# EAGLE schematic DCLoad (EAGLE 6.5.0)
20W Dynamic DC Contant Current Electonic Load
PART_NUM: DCL1B; REV: B; TITLE: Constant Current DC Load Project
Assembly variants: BASE, NOTEMPFAN, NOLOADBTN
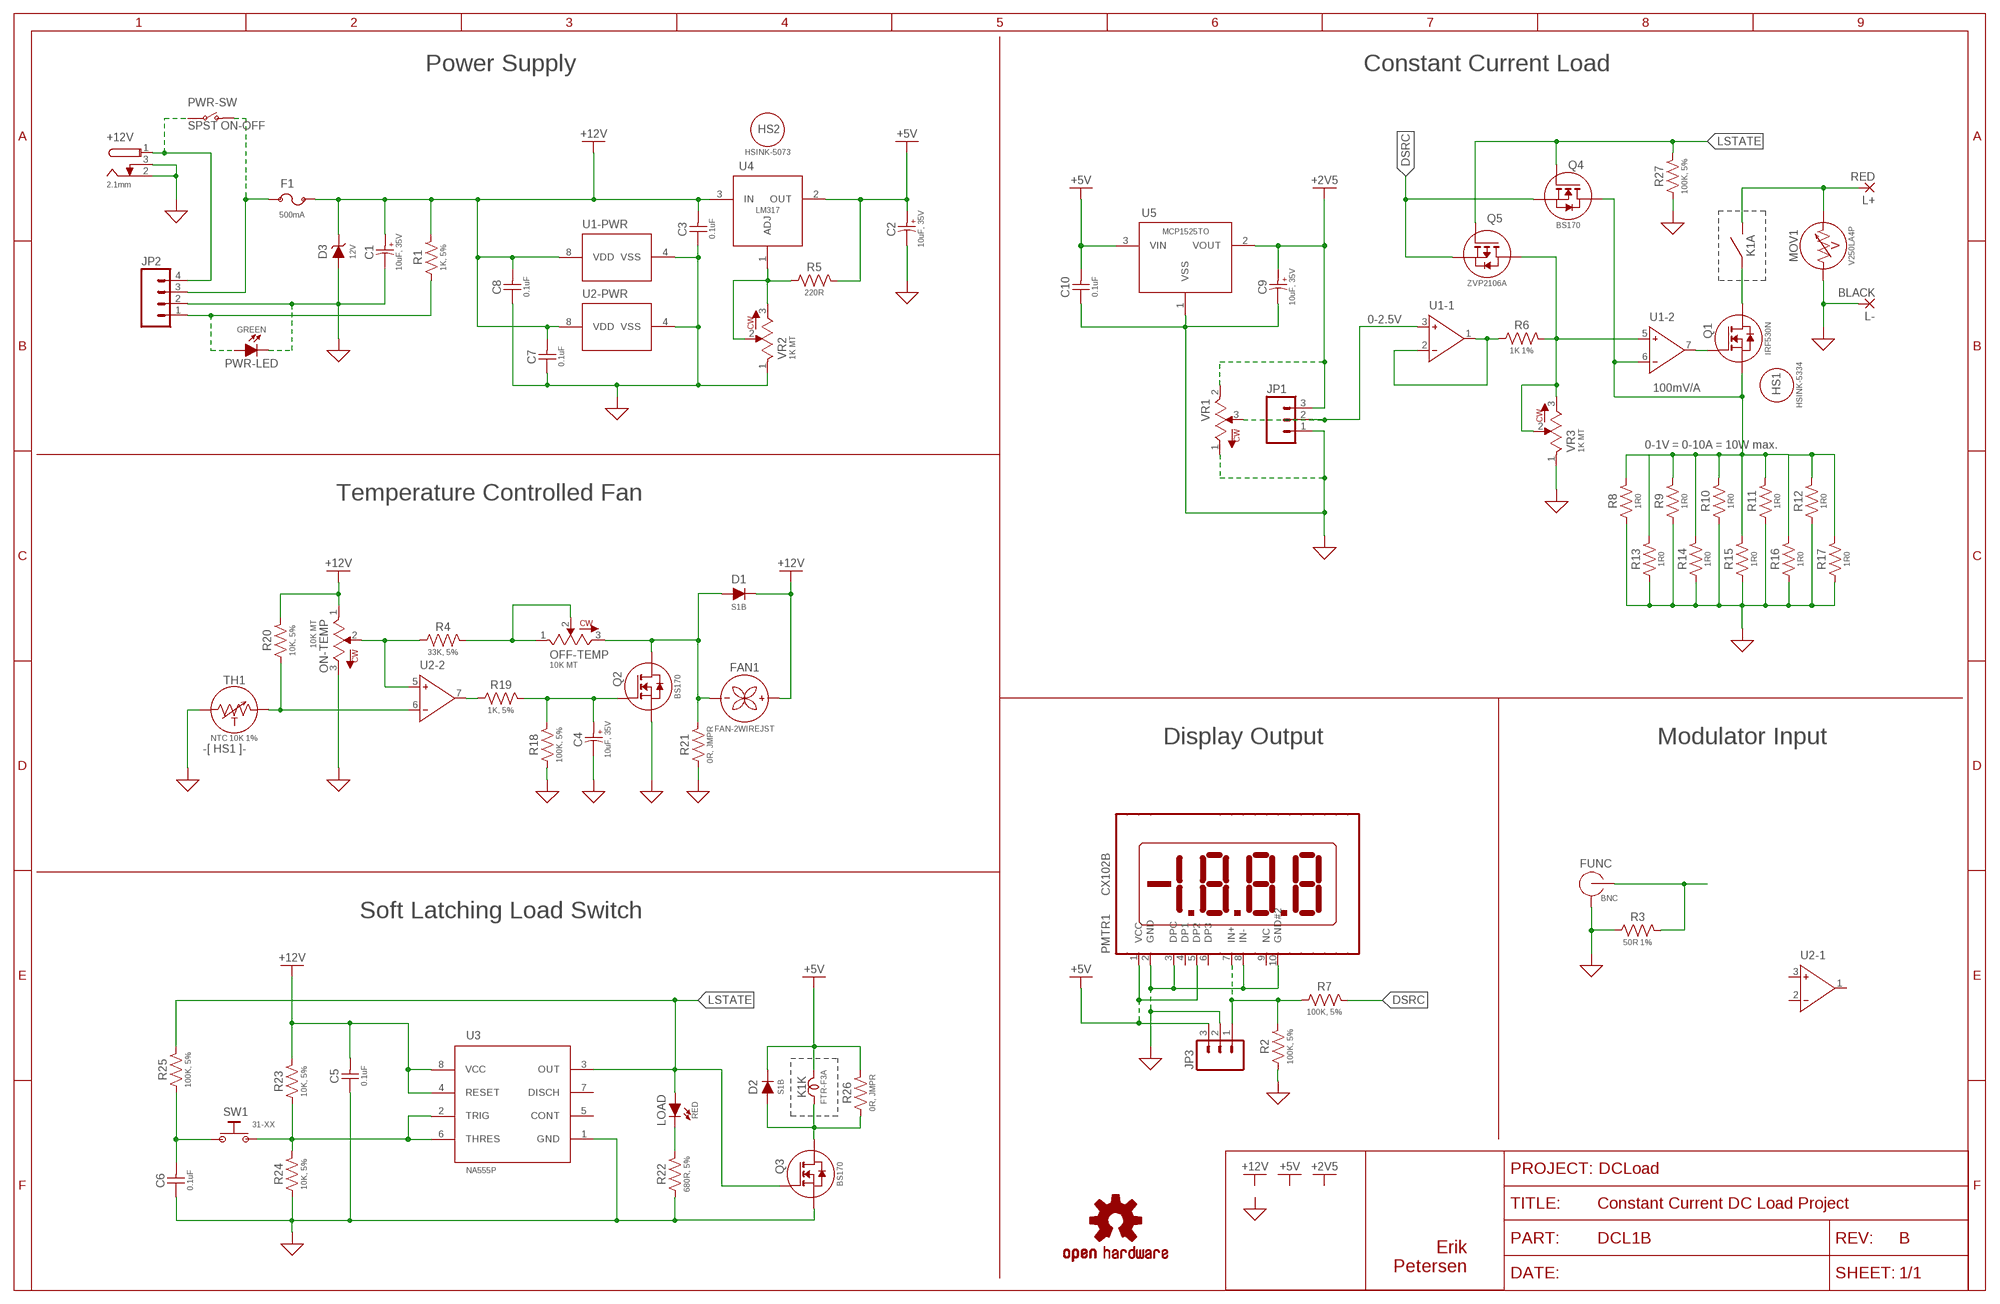
[diagram p0: schematic, sheet 1]

## Parts
+12V  2.1mm  DCJACK-PJ-102A  [PJ-102A]
C1  10uF, 35V  UPW1V100MDD-5MM  [5RAL]
C2  10uF, 35V  UPW1V100MDD-5MM  [5RAL]
C3  0.1uF  GRM188R71E104KA01  [18-0603]
C4  10uF, 35V  UPW1V100MDD-5MM  [5RAL]
C5  0.1uF  GRM188R71E104KA01  [18-0603]
C6  0.1uF  GRM188R71E104KA01  [18-0603]
C7  0.1uF  GRM188R71E104KA01  [18-0603]
C8  0.1uF  GRM188R71E104KA01  [18-0603]
C9  10uF, 35V  UPW1V100MDD-5MM  [5RAL]
C10  0.1uF  GRM188R71E104KA01  [18-0603]
D1  S1B  [DO-214AC]
D2  S1B  [DO-214AC]
D3  12V  SMAJ  [DO-214AC]
F1  500mA  1206L025  [1206]
FAN1  FAN-2WIREJST  [JST-2-PTH]
FUNC  BNC  BNCPTH  [BNC]
HS1  HSINK-5334  [5334]
HS2  HSINK-5073  [5073]
JP1  M03POLAR  [MOLEX-1X3]
JP2  M04POLAR  [MOLEX-1X4]
JP3  M03POLAR  [MOLEX-1X3]
K1  FTR-F3A  [FTR-F3STD]
L+  RED  WIREPAD2,54/1,0  [2,54/1,0]
L-  BLACK  WIREPAD2,54/1,0  [2,54/1,0]
LOAD  RED  LED5MM  [LED5MM]
LOGO1  OSHW-LOGOM  [OSHW-LOGO-M]
MOV1  V250LA4P  [S07K17]
OFF-TEMP  10K MT  3296_TRIMPOTW  [3296W]
ON-TEMP  10K MT  3296_TRIMPOTW  [3296W]
PMTR1  CX102B  CX102-PANELMETER  [CX102]
PWR-LED  GREEN  LED5MM  [LED5MM]
PWR-SW  SPST ON-OFF  SWITCH-SPST-2TV  [SWITCH-SPST-VERTICAL]
Q1  IRF530N  [TO220-3]
Q2  BS170  MOSFET-NCHANNELBS170  [TO-92]
Q3  BS170  MOSFET-NCHANNELBS170  [TO-92]
Q4  BS170  MOSFET-NCHANNELBS170  [TO-92]
Q5  ZVP2106A  MOSFET-PCHANNELZVP2106A  [TO-92]
R1  1K, 5%  ERJ-3GEYJ102V  [R0603]
R2  100K, 5%  ERJ-3GEYJ104V  [R0603]
R3  50R 1%  R  [0204/7]
R4  33K, 5%  ERJ-3GEYJ333V  [R0603]
R5  220R  R  [0204/7]
R6  1K 1%  R  [0204/7]
R7  100K, 5%  ERJ-3GEYJ104V  [R0603]
R8  1R0  CRCW2512A1R0FK  [2512]
R9  1R0  CRCW2512A1R0FK  [2512]
R10  1R0  CRCW2512A1R0FK  [2512]
R11  1R0  CRCW2512A1R0FK  [2512]
R12  1R0  CRCW2512A1R0FK  [2512]
R13  1R0  CRCW2512A1R0FK  [2512]
R14  1R0  CRCW2512A1R0FK  [2512]
R15  1R0  CRCW2512A1R0FK  [2512]
R16  1R0  CRCW2512A1R0FK  [2512]
R17  1R0  CRCW2512A1R0FK  [2512]
R18  100K, 5%  ERJ-3GEYJ104V  [R0603]
R19  1K, 5%  ERJ-3GEYJ102V  [R0603]
R20  10K, 5%  ERJ-3GEYJ103V  [R0603]
R21  0R, JMPR  ERJ-3GEY0R00V  [R0603]  (not fitted in variant BASE)  (not fitted in variant NOLOADBTN)
R22  680R, 5%  ERJ-3GEYJ681V  [R0603]
R23  10K, 5%  ERJ-3GEYJ103V  [R0603]
R24  10K, 5%  ERJ-3GEYJ103V  [R0603]
R25  100K, 5%  ERJ-3GEYJ104V  [R0603]
R26  0R, JMPR  ERJ-3GEY0R00V  [R0603]
R27  100K, 5%  ERJ-3GEYJ104V  [R0603]
SW1  31-XX  [B3F-31XX]
TH1  NTC 10K 1%  THERMISTOR-BEAD  [BEAD-THERM]
U1  TLC272ACP  [PDIP-8]
U2  TLC272ACP  [PDIP-8]
U3  NA555P  [DIP254P762X508-8]
U4  LM317  [TO-220AB]
U5  MCP1525TO  [TO127P254X495-3]
VR1  10TPOT  [10TPOT]
VR2  1K MT  3296_TRIMPOTW  [3296W]
VR3  1K MT  3296_TRIMPOTW  [3296W]

## Nets
+5V: C2.P D2.C JP3.3 K1.2 PMTR1.1(VCC) PMTR1.5(DP2) R5.2 R26.2 U4.2(OUT)
+12V: C1.P C3.2 C5.2 C7.2 C8.2 C10.2 D1.C D3.C F1.2 FAN1.2(NEG(-)) ON-TEMP.1 R1.2 R20.2 R23.2 U1.8(-PWR:VDD) U2.8(-PWR:VDD) U3.4(RESET) U3.8(VCC) U4.3(IN) U5.3(VIN) ; supply symbol labelled +5V
DSRC: Q4.3(S) Q5.3(S) R7.2
GND: +12V.2 +12V.3 C1.N C2.N C3.1 C4.N C5.1 C6.1 C7.1 C8.1 C9.N C10.1 D3.A FUNC.GND JP1.1 JP2.2 JP3.2 L-.1(P) MOV1.2 ON-TEMP.3 PMTR1.2(GND) PMTR1.3(DPC) PMTR1.8(IN-) PMTR1.10(GND#2) PWR-LED.K(C) Q2.3(S) Q3.3(S) R2.1 R3.1 R8.1 R9.1 R10.1 R11.1 R12.1 R13.1 R14.1 R15.1 R16.1 R17.1 R18.1 R21.1 R22.1 R24.1 R27.1 TH1.P$1 U1.4(-PWR:VSS) U2.4(-PWR:VSS) U3.1(GND) U5.1(VSS) VR1.1 VR2.1 VR3.1
LSTATE: LOAD.A Q3.2(G) Q4.2(G) Q5.2(G) R25.2 R27.2 U3.3(OUT)
N$1: FUNC.S(OUT) R3.2
N$2: +12V.1 JP2.4 PWR-SW.2(P)
N$3: Q1.1(G) U1.7(-2:OUT)
N$4: R5.1 U4.1(ADJ) VR2.2 VR2.3
N$5: K1.4 L+.1(P) MOV1.1
N$6: D1.A FAN1.1(POS(+)) OFF-TEMP.3 Q2.1(D) R21.2
N$7: R20.1 TH1.P$2 U2.6(-2:IN-)
N$8: ON-TEMP.2 R4.1 U2.5(-2:IN+)
N$9: R19.1 U2.7(-2:OUT)
N$10: D2.A K1.1 Q3.1(D) R26.1
N$11: C4.P Q2.2(G) R18.2 R19.2
N$12: OFF-TEMP.1 OFF-TEMP.2 R4.2
N$13: C6.2 R25.1 SW1.1
N$15: R6.1 U1.1(-1:OUT) U1.2(-1:IN-)
N$16: LOAD.K(C) R22.2
N$17: R23.1 R24.2 SW1.2 U3.2(TRIG) U3.6(THRES)
N$19: F1.1 JP2.3 PWR-SW.1(O)
N$20: JP1.2 U1.3(-1:IN+) VR1.3
N$21: K1.3 Q1.2(D)
N$23: JP3.1 PMTR1.7(IN+) R2.2 R7.1
N$24: JP2.1 PWR-LED.A R1.1
SENSE: Q1.3(S) Q4.1(D) R8.2 R9.2 R10.2 R11.2 R12.2 R13.2 R14.2 R15.2 R16.2 R17.2 U1.6(-2:IN-)
SET: Q5.1(D) R6.2 U1.5(-2:IN+) VR3.2 VR3.3
VREF: C9.P JP1.3 U5.2(VOUT) VR1.2 ; supply symbol labelled +2V5
Unconnected: PMTR1.4(DP1) PMTR1.6(DP3) PMTR1.9(NC) U2.1(-1:OUT) U2.2(-1:IN-) U2.3(-1:IN+) U3.5(CONT) U3.7(DISCH)

## Notes on the sheet
- Power Supply | Constant Current Load
- 0-2.5V
- 100mV/A
- 0-1V = 0-10A = 10W max.
- Temperature Controlled Fan
- Display Output | Modulator Input
- -[ HS1 ]-
- Soft Latching Load Switch

## Power pins joined to a net without a drawn wire
GND: SW1.GND@1(GND) SW1.GND@2(GND)

## Library data of the parts
+12V = C3-General:DCJACK-PJ-102A: CUI 2.1mm DC Power Jack PJ-102A - PCB Mount Datasheet <http://www.cui.com/product/resource/pj-102a.pdf> Octopart Entry <http://octopart.com/pj-102a-cui-286936>
C1 C2 C4 C9 = C3-Nichicon:UPW*-?: 5mm Diameter Radial Aluminium Electrolytic Capacitor; C: 10uF; TOLERANCE: 20%; V: 35V
C3 C5-C8 C10 = C3-Murata:GRM18*: Murata Chip Capacitor 0603 Size; SIZE: 0603; TEMPCO: X7R; TOLERANCE: ±10%; VOLTAGE: 25V
D1 D2 = C3-Diodes:S1*: Fairchild 1A, Glass-Passivated, Low-Leakage, Rectifiers; VRRM: 100V
D3 = C3-Littelfuse:SMAJ: SMAJ Unidirectional TVS Diode
F1 = C3-Littelfuse:1206L*: POLYFUSE® Resettable PTCs 1206L Series; I-HOLD: 250mA
FAN1 = C3-General:FAN-2WIRE
FUNC = C3-Connector:BNC: BNC Connector, Mouser Part# 5227161
HS1 HS2 = C3-Aavid:HSINK-?: Aavid Heatsink
JP1 JP3 = SparkFun-Connectors:M03: Header 3 Standard 3-pin 0.1" header. Use with straight break away headers (SKU : PRT-00116), right angle break away headers (PRT-00553), swiss pins (PRT-00743), machine pins (PRT-00117), and female headers (PRT-00115). Molex polarized connector foot print use with SKU : PRT-08232 with associated crimp pins and housings.
JP2 = SparkFun-Connectors:M04: Header 4 Standard 4-pin 0.1" header. Use with straight break away headers (SKU : PRT-00116), right angle break away headers (PRT-00553), swiss pins (PRT-00743), machine pins (PRT-00117), and female headers (PRT-00115). Molex polarized connector foot print use with SKU : PRT-08231 with associated crimp pins and housings. 1MM SMD Version SKU: PRT-10208
K1 = C3-SwitchRelayTriac:FTR-F3: Fujitsu FTR-F3 Series General Purpose Relay
L+ L- = C3-General:WIREPAD: Wire PAD connect wire on PCB
LOAD PWR-LED = C3-LED:LED
LOGO1 = C3-General:OSHW-LOGO: Open Source Hardware Logo This logo indicates the piece of hardware it is found on incorporates a OSHW license and/or adheres to the definition of open source hardware found here: http://freedomdefined.org/OSHW
MOV1 = C3-Littelfuse:V250LA4P: Varistor Datasheet <http://www.littelfuse.com/~/media/Electronics_Technical/Datasheets/Varistors/Littelfuse_Varistors_LA_Datasheet.pdf>
OFF-TEMP ON-TEMP VR2 VR3 = C3-RCL:3296_TRIMPOT
PMTR1 = C3-Modules:CX102-PANELMETER
PWR-SW = SparkFun-Electromechanical:SWITCH-SPST-2
Q1 = C3-General:IRF530N: IRF530N N-Channel MOSFET 100V 17A
Q2-Q4 = C3-SwitchRelayTriac:MOSFET-NCHANNEL: Common NMOSFET Parts MFG P/N Store ID Prod ID FDD8780 TRANS-09984 SI7820DN TRANS-11055 FDS6630A IC-08089 2N7002PW TRANS-11151 FQP30N06L COM-10213 TRANS-10060 BSS123LT1G TRANS-08345 BSS138 TRANS-00830 BS170 2N7000
Q5 = C3-SwitchRelayTriac:MOSFET-PCHANNEL: Generic PMOSFET
R1 R19 = C3-RCL:ERJ-3GEYJ102V: Panasonic 0603 Thick Film Resistor 1/10W, 5%, 1K
R2 R7 R18 R25 R27 = C3-RCL:ERJ-3GEYJ104V: Panasonic 0603 Thick Film Resistor 1/10W, 5%, 100K
R3 R5 R6 = C3-RCL:R
R4 = C3-RCL:ERJ-3GEYJ333V: Panasonic 0603 Thick Film Resistor 1/10W, 5%, 33K
R8-R17 = C3-RCL:CRCW?*: Vishay SMD Resistor
R20 R23 R24 = C3-RCL:ERJ-3GEYJ103V: Panasonic 0603 Thick Film Resistor 1/10W, 5%, 10K
R21 R26 = C3-RCL:ERJ-3GEY0R00V: Panasonic 0603 Thick Film Resistor 1/10W, Jumper, 0R
R22 = C3-RCL:ERJ-3GEYJ681V: Panasonic 0603 Thick Film Resistor 1/10W, 5%, 680R
SW1 = C3-Switches:31-XX: OMRON SWITCH; MPN: B3F-3100; OC_FARNELL: 959704; OC_NEWARK: 36M3582
TH1 = C3-RCL:THERMISTOR-BEAD: Frestanding Bead Thermistor on 50mm bendable wires like EPCOS B57861S
U1 U2 = C3-Ti:TLC272: TLC272 Dual Precision OPAMP
U3 = C3-Ti:NA555P: PRECISION TIMERS; MPN: NA555P; OC_FARNELL: 1755011; OC_NEWARK: 06M7353; PACKAGE: PDIP-8; SUPPLIER: Texas Instruments
U4 = C3-ONSemi:LM317: LM317 1.5A Adjustable Output, Positive Voltage Regulator
U5 = C3-Microchip:MCP1525: IC, SERIES V-REF, 2.5V, 1%; MPN: MCP1525-I/TO; OC_FARNELL: 1292235; OC_NEWARK: 89C7117; PACKAGE: TO-92; SUPPLIER: Microchip
VR1 = C3-RCL:10TPOT